# Altium schematic sheet Serial.SchDoc
size A4; SheetNumber: 5; SheetTotal: 8
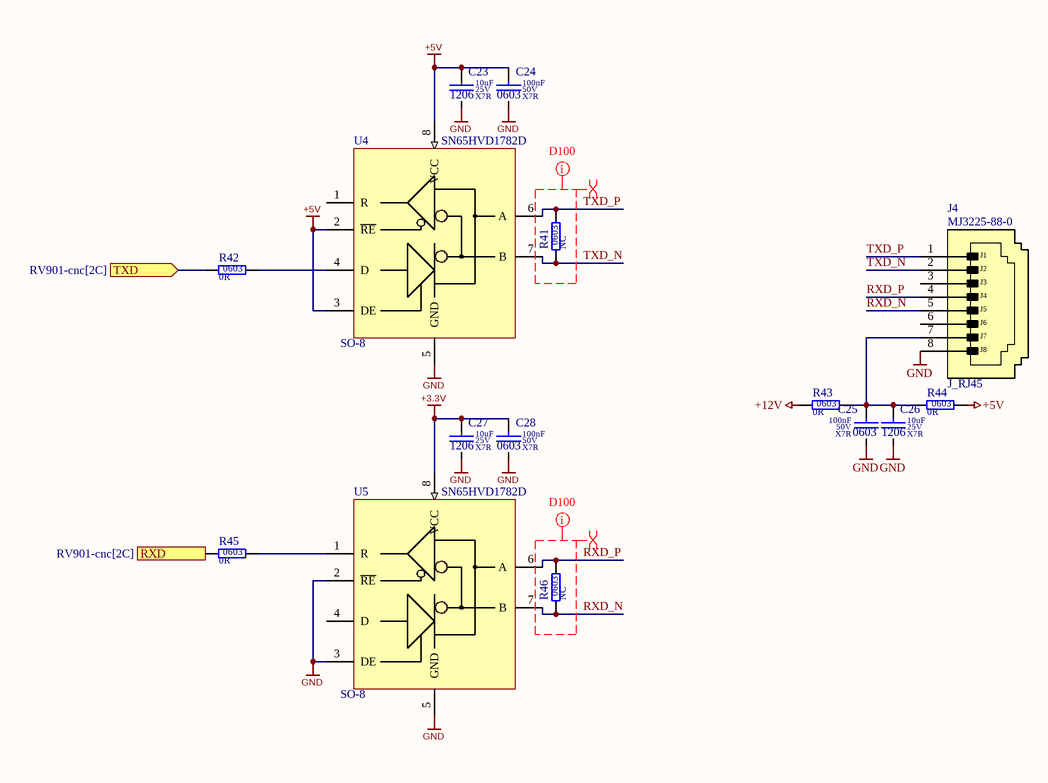
[diagram p0: Serial.SchDoc]

## Parts
C23  value 10uF  Dielectric: X7R  Voltage: 25V  SCH_Footprint: 1206  [C_1206_3216]  (hidden comment: Ceramic X7R)
C24  value 100nF  Dielectric: X7R  Voltage: 50V  SCH_Footprint: 0603  [C_0603_1608]  (hidden comment: Ceramic X7R)
C25  value 100nF  Dielectric: X7R  Voltage: 50V  SCH_Footprint: 0603  [C_0603_1608]  (hidden comment: Ceramic X7R)
C26  value 10uF  Dielectric: X7R  Voltage: 25V  SCH_Footprint: 1206  [C_1206_3216]  (hidden comment: Ceramic X7R)
C27  value 10uF  Dielectric: X7R  Voltage: 25V  SCH_Footprint: 1206  [C_1206_3216]  (hidden comment: Ceramic X7R)
C28  value 100nF  Dielectric: X7R  Voltage: 50V  SCH_Footprint: 0603  [C_0603_1608]  (hidden comment: Ceramic X7R)
J4  value MJ3225-88-0  [J_RJ45_MJ3225-88-0]  (hidden comment: Modular Connector, Modular Jack, 1 x 1 (Port), 8P8C, Cat3)
R41  value NC  SCH_Footprint: 0603  [R_NC_0603_1608]  (hidden comment: Resistor)
R42  value 0R  SCH_Footprint: 0603  [R_0603_1608]  (hidden comment: Resistor)
R43  value 0R  SCH_Footprint: 0603  [R_0603_1608]  (hidden comment: Resistor)
R44  value 0R  SCH_Footprint: 0603  [R_0603_1608]  (hidden comment: Resistor)
R45  value 0R  SCH_Footprint: 0603  [R_0603_1608]  (hidden comment: Resistor)
R46  value NC  SCH_Footprint: 0603  [R_NC_0603_1608]  (hidden comment: Resistor)
U4  value SN65HVD1782D  SCH_Footprint: SO-8  [SOP8_SO8_SOIC8_4X5X18]  (hidden comment: Transceiver)
U5  value SN65HVD1782D  SCH_Footprint: SO-8  [SOP8_SO8_SOIC8_4X5X18]  (hidden comment: Transceiver)

## Ports
RXD (out, see RV901-cnc[2C]), TXD (in, see RV901-cnc[2C])

## Nets
+3.3V: C27.1 C28.1 U5.8(VCC)
+5V: C23.1 C24.1 R44.2 U4.2(~{RE}) U4.3(DE) U4.8(VCC)
+12V: R43.1
GND: C23.2 C24.2 C25.2 C26.2 C27.2 C28.2 J4.8 U4.5(GND) U5.2(~{RE}) U5.3(DE) U5.5(GND)
RXD: R45.1 ; port RXD
RXD_N: J4.5 R46.1 U5.7(B)
RXD_P: J4.4 R46.2 U5.6(A)
TXD: R42.1 ; port TXD
TXD_N: J4.2 R41.1 U4.7(B)
TXD_P: J4.1 R41.2 U4.6(A)
NetC25_1: C25.1 C26.1 J4.7 R43.2 R44.1
NetR42_2: R42.2 U4.4(D)
NetR45_2: R45.2 U5.1(R)

Not connected (* = marked no-connect by the designer): J4 3 6; U4 1(R); U5 4(D)

## Layout directives
differential pair: (no net found under the mark)
net class D100: (no net found under the mark)

## Notes on the sheet
- (in symbol J_RJ45_MJ3225-88-0) J1; J2; J3; J5; J6; J7; J8

## Library data of the parts
C23 C26 C27 = C_10uF_25V_X7R_1206_10: Capacitor; Manufacturer: Samsung; Manufacturer Part Number: CL31B106KAHNNNE; Tolerance (%): 10; Part Number: C_10uF_25V_X7R_1206_10; HelpURL: http://www.tme.eu/pl/Document/4a42202b32dab16128fe107dd69598cc/samsung-chip-cap.pdf; Supplier 1: TME; Supplier Part Number 1: CL31B106KAHNNNE; Supplier 2: RS Components; Supplier Part Number 2: 766-6773; Supplier 3: Farnell; Supplier Part Number 3: 3013526; Supplier 4: Mouser; Supplier Part Number 4: 187-CL31B106KAHNNNE; Supplier 5: Digi-Key; Supplier Part Number 5: 1276-1804-1-ND; Supplier 6: LCSC
C24 C25 C28 = C_100nF_50V_X7R_0603_5: Capacitor; Manufacturer: Samsung; Manufacturer Part Number: CL10B104JB8NNNC; Tolerance (%): 5; Part Number: C_100nF_50V_X7R_0603_5; HelpURL: http://www.tme.eu/pl/Document/4a42202b32dab16128fe107dd69598cc/samsung-chip-cap.pdf; Supplier 1: TME; Supplier Part Number 1: CL10B104JB8NNNC; Supplier 2: RS Components; Supplier Part Number 2: 7665455; Supplier 3: Farnell; Supplier 4: Mouser; Supplier 5: Digi-Key; Supplier Part Number 5: 1276-1033-1-ND; Supplier 6: LCSC; Supplier Part Number 6: C24452
J4 = J_RJ45_MJ3225-88-0: Manufacturer: Global Connector Technology; SCH_Footprint: J_RJ45; Part Number: J_RJ45_MJ3225-88-0; HelpURL: https://www.farnell.com/cad/3781788.pdf; Manufacturer Part Number: MJ3225-88-0; Supplier 1: TME; Supplier 2: RS Components; Supplier 3: Farnell; Supplier Part Number 3: 4071641; Supplier 4: Mouser; Supplier 5: Digi-Key; Supplier 6: LCSC; Supplier 7: Newark; Supplier Part Number 7: 61AK4308
R41 R46 = R_GENERIC_0603: Part Number: R_GENERIC_0603; HelpURL: -; Manufacturer: -; Manufacturer Part Number: -; Supplier 1: TME; Supplier 2: RS Components; Supplier 3: Farnell; Supplier 4: Mouser; Supplier 5: Digi-Key; Supplier 6: LCSC
R42-R45 = R_0R_0603_1: Manufacturer: Yageo; Manufacturer Part Number: RC0603FR-070RL; Voltage: 75V; Power: 100mW; Tolerance: 1%; Part Number: R_0R_0603_1; HelpURL: https://datasheet.octopart.com/RC0603FR-070RL-Yageo-datasheet-8328172.pdf; Supplier 1: TME; Supplier Part Number 1: RC0603FR-070RL; Supplier 2: RS Components; Supplier 3: Farnell; Supplier Part Number 3: 2309106; Supplier 4: Mouser; Supplier Part Number 4: 603-RC0603FR-070RL; Supplier 5: Digi-Key; Supplier Part Number 5: 311-0.0HRCT-ND; Supplier 6: LCSC; Supplier Part Number 6: C100044
U4 U5 = U_SN65HVD1782DR: Fault-Protected  RS-485  Transceivers  With 3.3-V to 5-V Operation; Manufacturer: Texas Instruments; Part Number: U_SN65HVD1782DR; HelpURL: http://www.ti.com/lit/ds/slls877h/slls877h.pdf; Manufacturer Part Number: SN65HVD1782D; Supplier 1: TME; Supplier 2: RS Components; Supplier Part Number 2: 7093179P; Supplier 3: Farnell; Supplier Part Number 3: 1755056; Supplier 4: Mouser; Supplier Part Number 4: 595-SN65HVD1782D; Supplier 5: Digi-Key; Supplier Part Number 5: 296-33574-5-ND; Supplier 6: LCSC